# Altium project PCB.PrjPcb
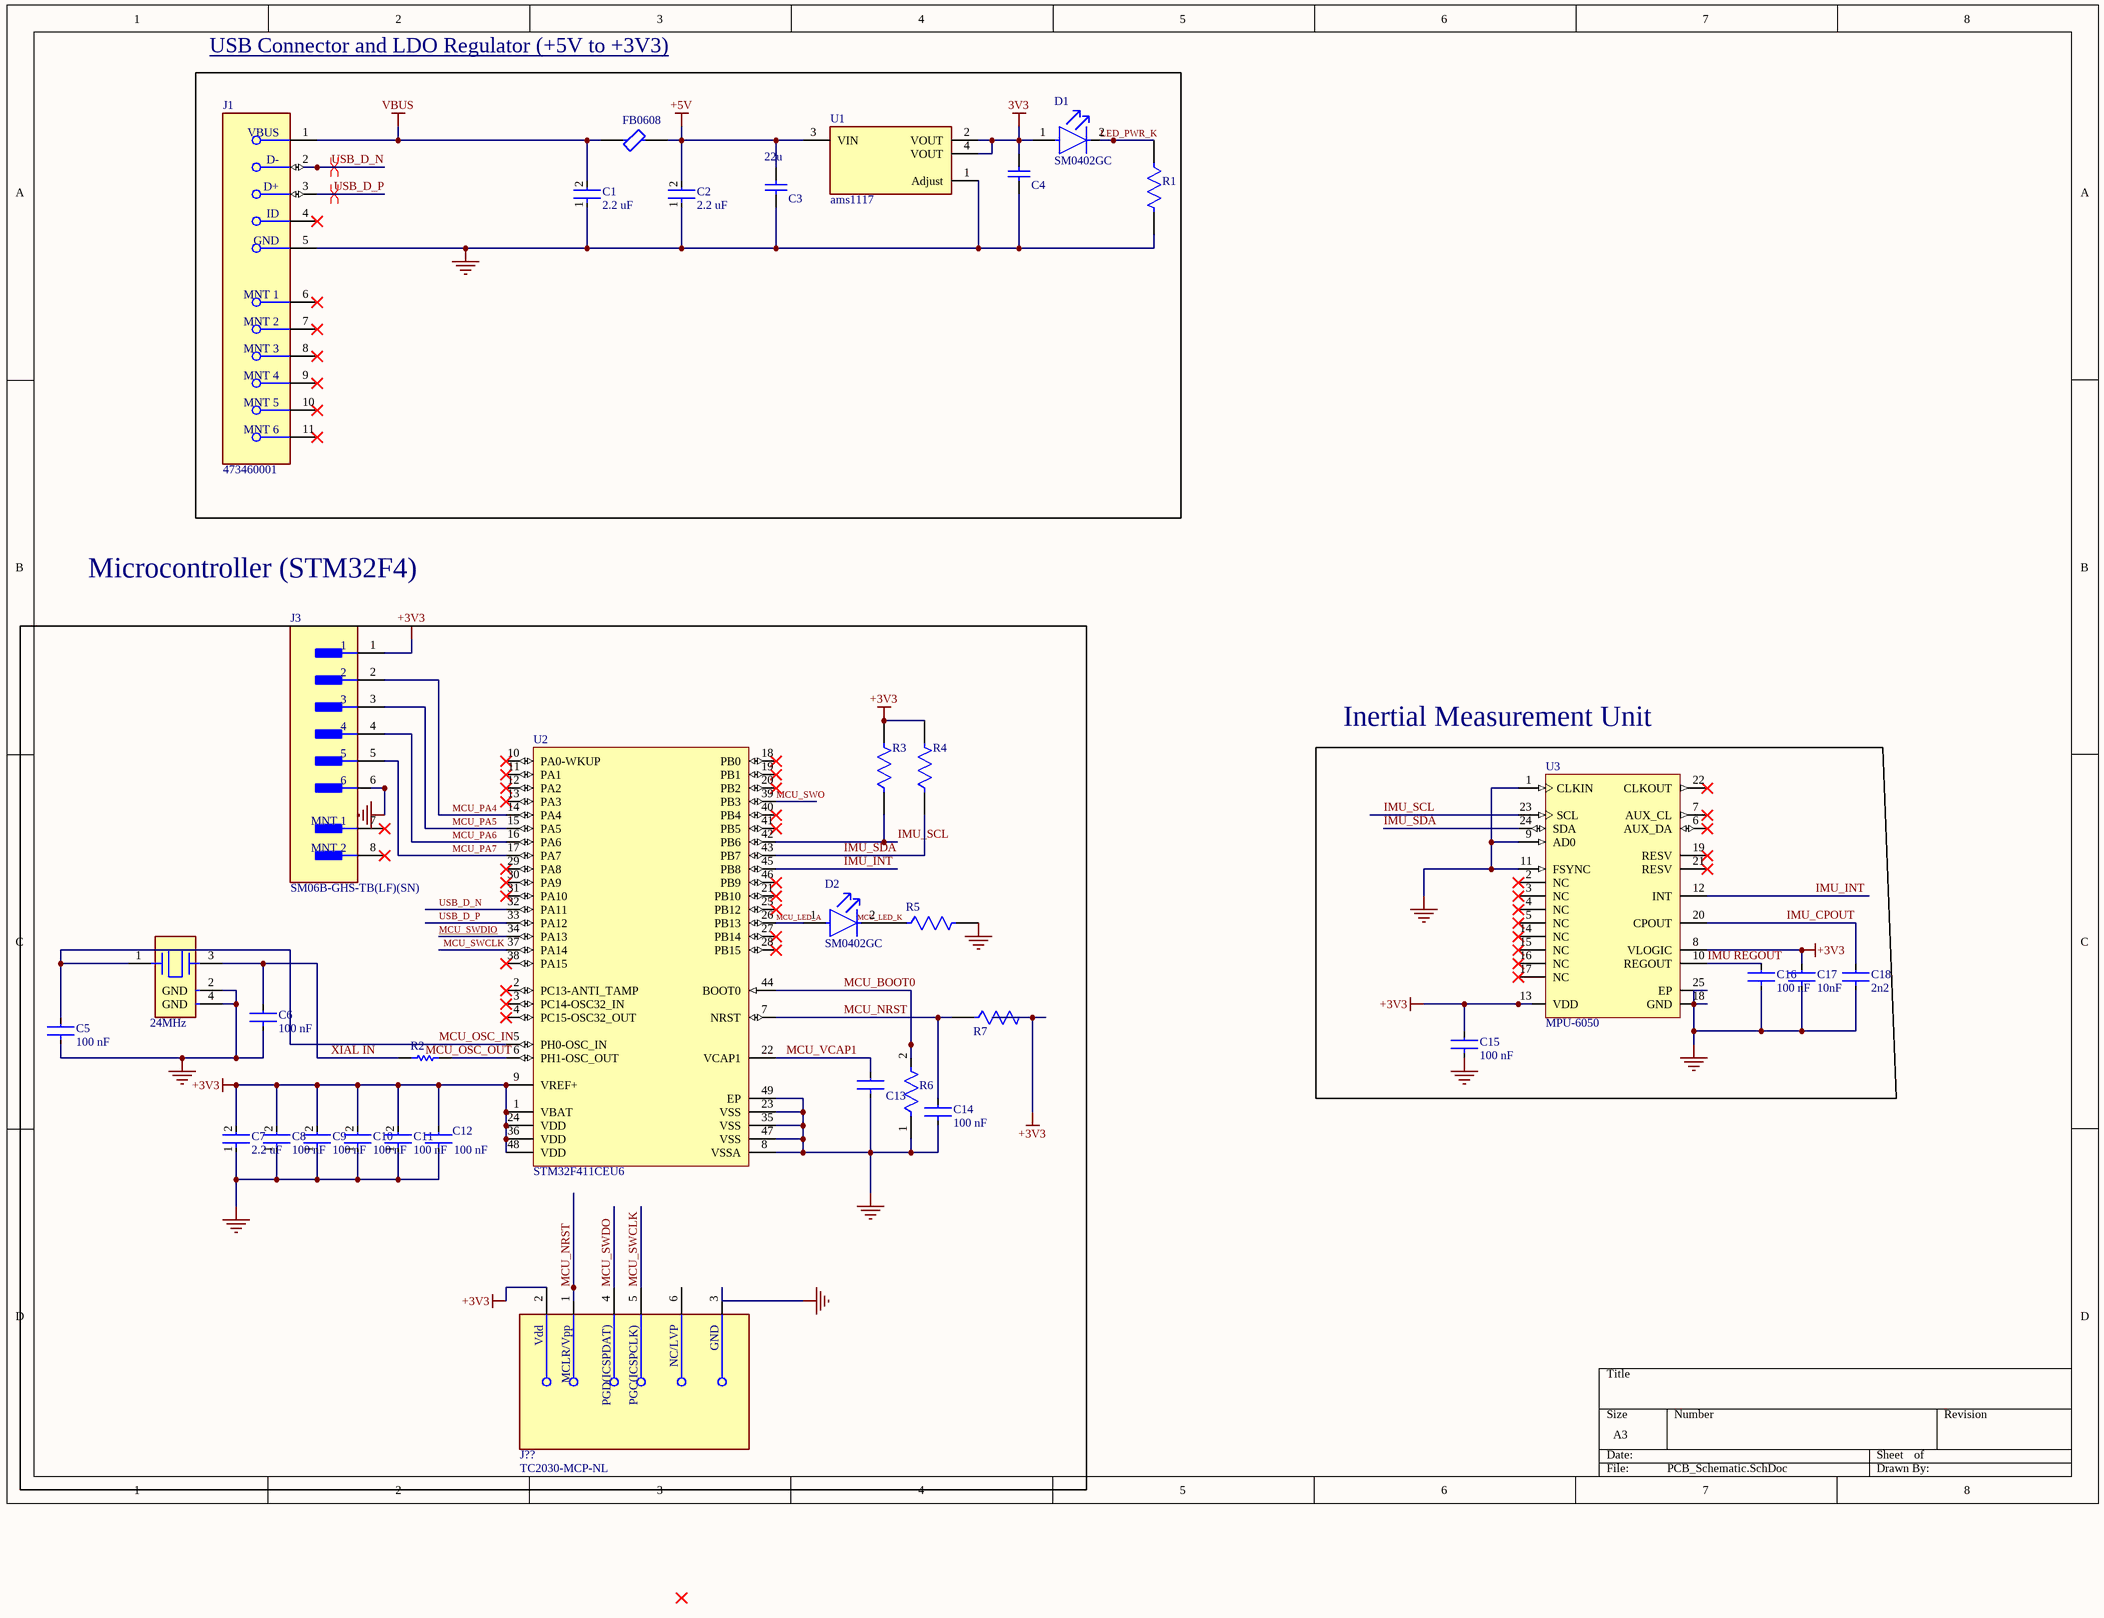
[diagram p0: PCB_Schematic.SchDoc]
1 sheet, 35 parts. Net scope: global (net labels, ports and power ports of the same name join across sheets).

## Sheet PCB_Schematic.SchDoc
size A3; SheetNumber: 1; SheetTotal: 1

### Parts
24MHz  7M-24.000MEEQ-T  [FP-7M-MFG]  (value not drawn)
?  C13  [FP-C0402-BB-MFG]
C1  2.2 uF  [FP-C0402-BB-MFG]
C2  2.2 uF  [FP-C0402-BB-MFG]
C3  22u  [CAPC2013X140X50NL20T25]
C4  2u2  [CAPC2013X140X50NL20T25]  (value not drawn)
C5  100 nF  [FP-C0402-BB-MFG]
C6  100 nF  [FP-C0402-BB-MFG]
C7  2.2 uF  [FP-C0402-BB-MFG]
C8  100 nF  [FP-C0402-BB-MFG]
C9  100 nF  [FP-C0402-BB-MFG]
C10  100 nF  [FP-C0402-BB-MFG]
C11  100 nF  [FP-C0402-BB-MFG]
C12  100 nF  [FP-C0402-BB-MFG]
C14  100 nF  [FP-C0402-BB-MFG]
C15  100 nF  [FP-C0402-BB-MFG]
C16  100 nF  [FP-C0402-BB-MFG]
C17  10nF  [FP-C0402-BB-MFG]
C18  2n2  [FP-C0402-BB-MFG]
D1  SM0402GC  [FP-SM0402GC-MFG]
D2  SM0402GC  [FP-SM0402GC-MFG]
FB0608  FBMH1608HM101-TV  [FP-FBMH1608-IPC_A]  (value not drawn)
J1  473460001  [FP-473460001-MFG]
J3  SM06B-GHS-TB(LF)(SN)  [FP-SM06B-GHS-TB_LF_SN-MFG]
J??  TC2030-MCP-NL  [TC2030-IDC-NL]
R1  CRCW0805330RJNEA  [FP-CRCW0805-e3-IPC_C]  (value not drawn)
R2  CRG0805ZR  [RESC2013X65X40LL15T20]  (value not drawn)
R3  MCU08050D2201BP500  [FP-MCU0805-MFG]  (value not drawn)
R4  MCU08050D2201BP500  [FP-MCU0805-MFG]  (value not drawn)
R5  RMCF1206FG1K00  [FP-RMCF1206-IPC_C]  (value not drawn)
R6  AC0402DR-0710K7L  [FP-AC0402-IPC_A]  (value not drawn)
R7  AC0603JR-7W10KL  [FP-AC0603-IPC_A]  (value not drawn)
U1  ams1117  [FP-ams1117-IPC_C]
U2  STM32F411CEU6  [STM-UFQFPN48_L]
U3  MPU-6050  [IS-QFN-24_V]

### Blocks framed on the sheet
USB Connector and LDO Regulator (+5V to +3V3): C1-C4 D1 FB0608 J1 R1 U1
Inertial Measurement Unit: C15-C18 U3

### Nets
3V3: C4.2 D1.1(A) U1.2(VOUT) U1.4(VOUT)
+3V3: C7.2 C8.2 C9.2 C10.2 C11.2 C12.2 C15.2 C17.2 J3.1 J??.2(Vdd) R3.2 R4.2 R7.2 U2.1(VBAT) U2.9(VREF+) U2.24(VDD) U2.36(VDD) U2.48(VDD) U3.8(VLOGIC) U3.13(VDD)
+5V: C2.2 C3.2 FB0608.2 U1.3(VIN)
GND: 24MHz.2(GND) 24MHz.4(GND) ?.1 C1.1 C2.1 C3.1 C4.1 C5.1 C6.1 C7.1 C8.1 C9.1 C10.1 C11.1 C12.1 C14.1 C15.1 C16.1 C17.1 C18.1 J1.5(GND) J3.6 J??.3(GND) R1.2 R5.2 R6.1 U1.1(Adjust) U2.8(VSSA) U2.23(VSS) U2.35(VSS) U2.47(VSS) U2.49(EP) U3.1(CLKIN) U3.9(AD0) U3.11(FSYNC) U3.18(GND) U3.25(EP)
VBUS: C1.2 FB0608.1 J1.1(VBUS)
IMU REGOUT: C16.2 U3.10(REGOUT)
IMU_CPOUT: C18.2 U3.20(CPOUT)
IMU_INT: U2.45(PB8) U3.12(INT)
IMU_SCL: R3.1 U2.42(PB6) U3.23(SCL)
IMU_SDA: R4.1 U2.43(PB7) U3.24(SDA)
LED_PWR_K: D1.2(C) R1.1
MCU_BOOT0: R6.2 U2.44(BOOT0)
MCU_LED_A: D2.1(A) U2.26(PB13)
MCU_NRST: C14.2 J??.1(MCLR/Vpp) R7.1 U2.7(NRST)
MCU_OSC_IN: 24MHz.1 C5.2 U2.5(PH0-OSC_IN)
MCU_PA4: J3.2 U2.14(PA4)
MCU_PA5: J3.3 U2.15(PA5)
MCU_PA6: J3.4 U2.16(PA6)
MCU_PA7: J3.5 U2.17(PA7)
MCU_SWCLK: J??.5(PGC(ICSPCLK)) U2.37(PA14)
MCU_SWDIO: U2.34(PA13)
MCU_SWDO: J??.4(PGD(ICSPDAT))
MCU_SWO: U2.39(PB3)
MCU_VCAP1: ?.2 U2.22(VCAP1)
USB_D_N: J1.2(D-) U2.32(PA11)
USB_D_P: J1.3(D+) U2.33(PA12)
XIAL IN: 24MHz.3 C6.2 R2.1
NetD2_2: D2.2(C) R5.1
NetR2_2: R2.2 U2.6(PH1-OSC_OUT)

Not connected (* = marked no-connect by the designer): J1 4(ID)* 6(MNT_1)* 7(MNT_2)* 8(MNT_3)* 9(MNT_4)* 10(MNT_5)* 11(MNT_6)*; J3 7(MNT_1)* 8(MNT_2)*; J?? 6(NC/LVP); U2 2(PC13-ANTI_TAMP)* 3(PC14-OSC32_IN)* 4(PC15-OSC32_OUT)* 10(PA0-WKUP)* 11(PA1)* 12(PA2)* 13(PA3)* 18(PB0)* 19(PB1)* 20(PB2)* 21(PB10)* 25(PB12)* 27(PB14)* 28(PB15)* 29(PA8)* 30(PA9)* 31(PA10)* 38(PA15)* 40(PB4)* 41(PB5)* 46(PB9)*; U3 2(NC)* 3(NC)* 4(NC)* 5(NC)* 6(AUX_DA)* 7(AUX_CL)* 14(NC)* 15(NC)* 16(NC)* 17(NC)* 19(RESV)* 21(RESV)* 22(CLKOUT)*

### Layout directives
differential pair; differential pair class DIFF_USB: USB_D_N, USB_D_P

### Notes on the sheet
- Microcontroller (STM32F4)
- Labels drawn without touching a wire or pin: MCU_LED_K, MCU_OSC_OUT

### Library data of the parts
24MHz = CMP-18717-000318-1: Crystal 24MHz, 10ppm, 10pF, 50Ω; ESR (Equivalent Series Resistance): 60R; Lead Free: Lead Free; Packaging: Tape and Reel; Length: 3.2mm; Frequency: 24MHz; Load Capacitance: 10pF; REACH SVHC: No SVHC; Width: 0.098inch; Height: 0.031inch; Tolerance: 10ppm; Frequency Stability: 10ppm; Min Operating Temperature: -20°C; Max Operating Temperature: 70°C; Frequency Tolerance: 10ppm; Number of Pins: 4; Mount: Surface Mount; Termination: SMD/SMT; Case/Package: SMD/SMT; Package Quantity: 3000; Depth: 2.5mm; Series: 7M
? = CMP-1034-01425-3: Capacitor, Ceramic, 330Pf, 16Vdc, 10-% Tol, 10+% Tol, X7r-Tc Code, -15, 15%-Tc Rohs Compliant: Yes; Manufacturer Part Number: C0402C331K4RACTU; Manufacturer: Kemet; Voltage Rating: 16 V; Temperature Characteristic: X7R; Tolerance: 0.1; Capacitance: 2.2 uF; Temperature Coefficient: 15%; Value: 2.2 uF; Category: Cap; ComponentLink2Description: Datasheet; Lead Free: Yes; Mouser Description: Multilayer Ceramic Capacitors MLCC - SMD/SMT 16volts 330pF X7R 10%; Ipc Land Pattern Name: CAPC10050X50; Temperature Range High: +125°C; Temperature: -55°C to +125°C; Digikey Description: Capacitor, Ceramic, 330Pf, 16Vdc, 10-% Tol, 10+% Tol, X7r-Tc Code, -15, 15%-Tc Rohs Compliant: Yes; Automotive: No; Package: C0402-BB; Height: 0.55mm; Material: Ceramic; ComponentLink2URL: https://content.kemet.com/datasheets/KEM_C1002_X7R_SMD.pdf; Device Class L1: Passive Components; Temperature Range Low: -55°C; Device Class L3: Ceramic Capacitors; Device Class L2: Capacitors; Octopart: https://octopart.com/c0402c331k4ractu-kemet-9139363; RoHS: TRUE; Parameter 1: *
C1 C2 C5-C12 C14-C16 = CMP-1034-01425-3: Capacitor, Ceramic, 330Pf, 16Vdc, 10-% Tol, 10+% Tol, X7r-Tc Code, -15, 15%-Tc Rohs Compliant: Yes; Manufacturer Part Number: C0402C331K4RACTU; Manufacturer: Kemet; Voltage Rating: 16 V; Temperature Characteristic: X7R; Tolerance: 0.1; Temperature Coefficient: 15%; Category: Cap; ComponentLink2Description: Datasheet; Lead Free: Yes; Mouser Description: Multilayer Ceramic Capacitors MLCC - SMD/SMT 16volts 330pF X7R 10%; Ipc Land Pattern Name: CAPC10050X50; Temperature Range High: +125°C; Temperature: -55°C to +125°C; Digikey Description: Capacitor, Ceramic, 330Pf, 16Vdc, 10-% Tol, 10+% Tol, X7r-Tc Code, -15, 15%-Tc Rohs Compliant: Yes; Automotive: No; Package: C0402-BB; Height: 0.55mm; Material: Ceramic; ComponentLink2URL: https://content.kemet.com/datasheets/KEM_C1002_X7R_SMD.pdf; Device Class L1: Passive Components; Temperature Range Low: -55°C; Device Class L3: Ceramic Capacitors; Device Class L2: Capacitors; Octopart: https://octopart.com/c0402c331k4ractu-kemet-9139363; RoHS: TRUE; Parameter 1: *
  C1 C2 C7: Capacitance: 2.2 uF; Value: 2.2 uF
  C5 C6 C8-C12 C14-C16: Capacitance: 100 nF; Value: 100 nF
C3 C4 = CMP-2007-03253-1: Manufacturer: Kemet; Part Number: C0805C185K4RACTU
C17 C18 = CMP-1034-01425-3: Capacitor, Ceramic, 330Pf, 16Vdc, 10-% Tol, 10+% Tol, X7r-Tc Code, -15, 15%-Tc Rohs Compliant: Yes; Manufacturer Part Number: C0402C331K4RACTU; Manufacturer: Kemet; Voltage Rating: 16 V; Temperature Characteristic: X7R; Tolerance: 0.1; Capacitance: 100 nF; Temperature Coefficient: 15%; Value: 100 nF; Category: Cap; ComponentLink2Description: Datasheet; Lead Free: Yes; Mouser Description: Multilayer Ceramic Capacitors MLCC - SMD/SMT 16volts 330pF X7R 10%; Ipc Land Pattern Name: CAPC10050X50; Temperature Range High: +125°C; Temperature: -55°C to +125°C; Digikey Description: Capacitor, Ceramic, 330Pf, 16Vdc, 10-% Tol, 10+% Tol, X7r-Tc Code, -15, 15%-Tc Rohs Compliant: Yes; Automotive: No; Package: C0402-BB; Height: 0.55mm; Material: Ceramic; ComponentLink2URL: https://content.kemet.com/datasheets/KEM_C1002_X7R_SMD.pdf; Device Class L1: Passive Components; Temperature Range Low: -55°C; Device Class L3: Ceramic Capacitors; Device Class L2: Capacitors; Octopart: https://octopart.com/c0402c331k4ractu-kemet-9139363; RoHS: TRUE; Parameter 1: *
D1 D2 = CMP-35283-000001-2: LED GREEN CLEAR 0402 SMD; Lens Size: 1mm; Luminous Intensity: 28.5mcd; Viewing Angle: 130°; Forward Voltage: 1.9V; Test Current: 20mA; Lens Color: Colorless; Lens Style: Flat; Dominant Wavelength: 572nm; Case Code (Metric): 1005; Mount: Surface Mount; Case Code (Imperial): 0402; Length: 1mm; Width: 0.5mm; Case/Package: 0402; Lens Transparency: Clear; Height: 0.71mm; Packaging: Tape and Reel; Color: Green
FB0608 = CMP-14488-000006-2: None; Max Current Rating: 2.5A; DC Resistance (DCR): 35mR; Number of Lines: 1; Tolerance: 25%; Impedance: 100R; Test Frequency: 100MHz; Core Material: Ferrite; Max DC Current: 2A; Case Code (Metric): 1608; RoHS Compliant: Yes; Weight: 7.1E-05oz; Height: 0.8mm; Mount: Surface Mount; Ratings: AEC-Q200; Width: 0.031inch; Length: 0.063inch; Package Quantity: 4000; Termination: SMD/SMT; Case/Package: 0603; Packaging: Tape and Reel; Max Operating Temperature: 125°C; Case Code (Imperial): 0603; Min Operating Temperature: -40°C
J1 = CMP-2000-05246-2: CONN RCPT USB2.0 MICRO B SMD R/A; Manufacturer: Molex; Conn Orientation: Right Angle; Is Female: yes; Shielding: true; Pitch: 0.65mm; Number Of Contacts: 5; Voltage Rating: 30V; Current Rating: 1.8A; Device Class L2: USB Connectors; Digikey Description: CONN RCPT USB2.0 MICRO B SMD R/A; Height: 2.945mm; RoHS: TRUE; ComponentLink2Description: Datasheet; Octopart: https://octopart.com/47346-0001-molex-7164928; Automotive: No; Package: 0; Category: Conn; Device Class L1: Connectors; Usb Standard: USB 2.0; Temperature: -30°C to +85°C; Temperature Range Low: -30°C; Footprint Url: https://www.molex.com/pdm_docs/sd/473460001_sd.pdf; ComponentLink2URL: https://www.molex.com/webdocs/datasheets/pdf/en-us/0473460001_IO_CONNECTORS.pdf; Lead Free: Yes; Manufacturer Part Number: 473460001; Contact Material: Gold,Nickel; Temperature Range High: +85°C; Device Class L3: unset
J3 = CMP-17439-000061-1: CONN HEADER SMD R/A 6POS 1.25MM; Number of Contacts: 6; Voltage Rating: 50V; Current Rating: 1A; Connector Type: Outer Shroud Contact; Contact Resistance: 50mR; Orientation: Right Angle; Max Operating Temperature: 85°C; Mount: Surface Mount; Packaging: Tape and Reel; Contact Plating: Tin; Depth: 4.05mm; Max Voltage Rating (AC): 50V; Lead Free: Lead Free; Pitch: 1.25mm; Number of Positions: 6; Max Current Rating: 1A; Termination: Solder; Min Operating Temperature: -25°C; Housing Color: Beige; Fastening Type: Ramp; Length: 10.75mm; Color: Natural; Contact Material: Bronze; Housing Material: Polyamide; Number of Rows: 1
J?? = CMP-205963-000002-1: CABLE TAG-CONNECT IN-CIRCUIT; RoHS Compliant: Yes; Series: -; Reach SVHC Compliant: Yes; Package Quantity: 1; Lead Free: Lead Free
R1 = CMP-2001-03824-2: RES Thick Film, 330Ω, 5%, 0.125W, 200ppm/°C, 0805; Power Rating: 125mW; Voltage Rating (DC): 150V; Resistance: 330R; Case Code (Imperial): 0805; Temperature Coefficient: 200ppm/°C; Military Standard: Not; Tolerance: 5%; Max Power Dissipation: 125mW; Composition: Thick Film; Height: 0.02inch; Depth: 1.25mm; Termination: SMD/SMT; Voltage Rating: 150V; Max Operating Temperature: 155°C; Min Operating Temperature: -55°C; Number of Terminations: 2; Packaging: Tape and Reel; Radiation Hardening: No; Case/Package: 0805; Lead Free: Lead Free; Package Quantity: 1; Contact Plating: Tin; Length: 2mm; Case Code (Metric): 2012; Features: Automotive AEC-Q200; Weight: 0.000194oz; Width: 0.049inch
R2 = CMP-2000-07514-1: Chip Resistor, 0 Ohm, 0.125 W, -55 to 125 degC, 0805 (2012 Metric), RoHS, Tape and Reel; Manufacturer: TE Connectivity; Power Rating: 125mW; Voltage Rating: 150V; Tolerance: 0%; Case\/Package: 0805; Number of Resistors: 1; Resistance: 0mOhm; Datasheet URL: www.te.com/commerce/DocumentDelivery/DDEController?Action=showdoc&DocId=Customer+Drawing%7F1623401%7FBA%7Fpdf%7FEnglish%7FENG_CD_1623401_BA.pdf%7F1623401-1; Composition: ThickFilm; Max Operating Temperature: 125degC; Min Operating Temperature: -55degC; ELV: Compliant; Case Code (Metric): 2012; Number of Terminations: 2; Weight: 0.000194oz; Length: 2mm; Mount: SurfaceMount; Packaging: TapeandReel; Case Code (Imperial): 0805; RoHSCompliant: true; Width: 1.25mm; Radiation Hardening: No; Termination: Solder; Manufacturer URL: http://www.te.com/; Package Description: 2-Pin Surface Mount Device, Body 2 x 1.25 mm; Mounting Technology: SurfaceMount; Height: 0.55mm; Package Quantity: 5000; Package Reference: RESC2013X65X40L15T20; Datasheet Version: Rev. BA, 12/2009; Depth: 1.25mm
R3 R4 = CMP-02407-001865-1: RES 1.05K OHM 0.5% 1/5W 0805; Resistance: 2.2kR; Tolerance: 0.1%; Temperature Coefficient: 25ppm/°C; Max Power Dissipation: 125mW; Package Quantity: 5000; Packaging: Tape and Reel; Min Operating Temperature: -55°C; Military Standard: Not; Number of Terminations: 2; Max Operating Temperature: 125°C; Height: 0.022inch; Depth: 1.25mm; Composition: Thin Film; Width: 0.049inch; Case/Package: 0805; Length: 0.079inch; Lead Free: Lead Free
R5 = CMP-26527-005571-1: 1kΩ ±1% 0.25W 1206 Thick Film Chip Resistor AEC-Q200 compliant; Resistance: 1kR; Temperature Coefficient: 100ppm/°C; Max Power Dissipation: 250mW; Max Operating Temperature: 155°C; Contact Plating: Tin; Features: Automotive AEC-Q200; Min Operating Temperature: -55°C; Width: 0.063inch; Packaging: Tape and Reel; Number of Terminations: 2; Height: 0.028inch; Package Quantity: 10000; Series: RMCF; Case/Package: 1206; Radiation Hardening: No; Length: 0.126inch; RoHS Compliant: Yes; Mount: Surface Mount; Tolerance: 1%; Resistor Type: Thick Film
R6 = CMP-03412-007717-2: RES 10.7kΩ ±0.5% 0.063W 0402; RoHS Compliant: Yes
R7 = CMP-03412-040683-1: RES 10kΩ 5.00% 0.2W 0603
U1 = CMP-209535-000002-1: 1A LOW DROPOUT VOLTAGE REGULATOR; RoHS Compliant: Yes
U2 = CMP-0243-00165-1: ARM Cortex-M4 32-bit MCU+FPU, 512 KB Flash, 128 KB RAM, 36 I/Os, 48-Pin UFQFPN, -40 to 85 degC, Tray; Operating Frequency(F) (Processor speed) (MHz): 100; FLASH Size (Prog) (kB): 512; Internal RAM Size (kB): 128; I/Os (High Current): 36; Supply Voltage(Vcc) min (V): 1.7; Package Reference: 48-Pin Ultra Thin Fine Pitch Quad Flat No-Lead, 7 x 7 x 0.6 mm Body, 0.5 mm Pitch, Exposed Pad; ComponentLink1Description: Manufacturer URL; ComponentLink1URL: http://www.st.com/; Packing: Tray; Package Description: UFQFPN48; Core: ARM Cortex-M4; ComponentLink2Description: Datasheet; ComponentLink2URL: http://www.st.com/st-web-ui/static/active/en/resource/technical/document/datasheet/DM00115249.pdf; DatasheetVersion: Rev. 6; Mounting Technology: Surface Mount
U3 = CMP-1753-00002-2: 3-Axis Gyroscope, Accelerometer and a Digital Motion Processor(TM) (DMP), 2.375 to 3.46 V, -40 to 85 degC, 24-Pin QFN, RoHS, Tape and Reel; Manufacturer: InvenSense; Featured Product: MPU-60506-Axis,IntegratedI²CSolution; Other Names: 1428-1007-2 / MPU6050; Sensor Type: MotionTracking; Online Catalog: MPU-6000™Series; Unit PriceUSD: Digital; Datasheet Version: Rev. 3.3, 05/2012; Category: Sensors,Transducers; Datasheet URL: http://datasheet.octopart.com/MPU-6050-InvenSense-datasheet-14421344.pdf; Family: Multifunction; Standard Package: 5,000; Manufacturer URL: http://www.invensense.com/; Output Type: Digital; Dynamic Catalog: MPU-6000™Series